# EAGLE schematic DP-logic (EAGLE 8.3.2)
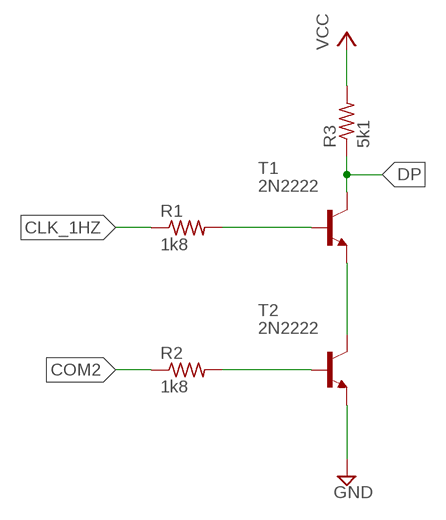
[diagram p0: schematic, sheet 1]

## Parts
R1  1k8  R-US_0204/7  [0204/7]
R2  1k8  R-US_0204/7  [0204/7]
R3  5k1  R-US_0204/7  [0204/7]
T1  2N2222  [TO92-EBC-OVAL]
T2  2N2222  [TO92-EBC-OVAL]

## Nets
CLK_1HZ: R1.1
COM2: R2.1
DP: R3.1 T1.C
GND: T2.E
N$1: R2.2 T2.B
N$2: R1.2 T1.B
N$3: T1.E T2.C
VCC: R3.2

## Library data of the parts
R1-R3 = adafruit:R-US_: RESISTOR, American symbol
T1 T2 = adafruit:2N2222: NPN TRANSISTOR Big oval pads